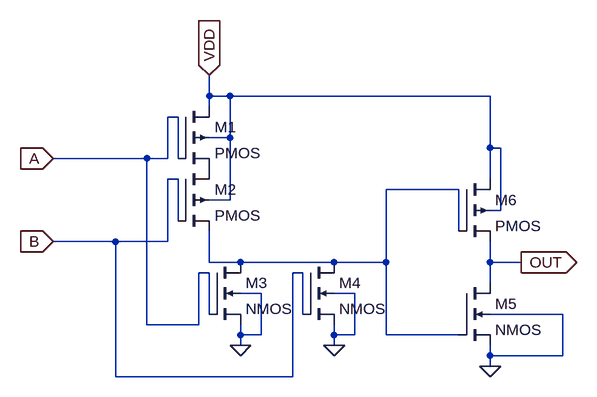
[diagram p0: schematic or.asc]
or.asc, the LTspice schematic file:
Version 4
SHEET 1 1084 680
WIRE 32 -32 32 -64
WIRE 64 -32 32 -32
WIRE 464 -32 64 -32
WIRE 32 -16 32 -32
WIRE -16 0 -32 0
WIRE 64 32 64 -32
WIRE 64 32 32 32
WIRE 464 48 464 -32
WIRE 480 48 464 48
WIRE -64 64 -208 64
WIRE -32 64 -32 0
WIRE -32 64 -64 64
WIRE -16 64 -16 0
WIRE -16 96 -32 96
WIRE 464 96 464 48
WIRE 416 112 304 112
WIRE 64 128 64 32
WIRE 64 128 32 128
WIRE 480 144 480 48
WIRE 480 144 464 144
WIRE -16 160 -16 96
WIRE 416 176 416 112
WIRE -112 192 -208 192
WIRE -32 192 -32 96
WIRE -32 192 -112 192
WIRE 32 224 32 176
WIRE 80 224 32 224
WIRE 224 224 80 224
WIRE 304 224 304 112
WIRE 304 224 224 224
WIRE 464 224 464 192
WIRE 512 224 464 224
WIRE 32 240 16 240
WIRE 176 240 160 240
WIRE 464 256 464 224
WIRE 112 272 80 272
WIRE 256 272 224 272
WIRE 32 304 32 240
WIRE 176 304 176 240
WIRE 576 304 464 304
WIRE -64 320 -64 64
WIRE 16 320 16 240
WIRE 16 320 -64 320
WIRE 80 336 80 320
WIRE 112 336 112 272
WIRE 112 336 80 336
WIRE 224 336 224 320
WIRE 256 336 256 272
WIRE 256 336 224 336
WIRE 304 336 304 224
WIRE 416 336 304 336
WIRE 80 352 80 336
WIRE 224 352 224 336
WIRE 464 368 464 352
WIRE 576 368 576 304
WIRE 576 368 464 368
WIRE 464 384 464 368
WIRE -112 400 -112 192
WIRE 160 400 160 240
WIRE 160 400 -112 400
FLAG 32 -64 VDD
IOPIN 32 -64 In
FLAG 80 352 0
FLAG 224 352 0
FLAG -208 64 A
IOPIN -208 64 In
FLAG -208 192 B
IOPIN -208 192 In
FLAG 464 384 0
FLAG 512 224 OUT
IOPIN 512 224 Out
SYMBOL pmos4 -16 -16 R0
SYMATTR InstName M1
SYMATTR Value2 l=90n w=400n
SYMBOL pmos4 -16 80 R0
SYMATTR InstName M2
SYMATTR Value2 l=90n w=400n
SYMBOL nmos4 32 224 R0
SYMATTR InstName M3
SYMATTR Value2 l=90n w=200n
SYMBOL nmos4 176 224 R0
SYMATTR InstName M4
SYMATTR Value2 l=90n w=200n
SYMBOL nmos4 416 256 R0
SYMATTR Value2 l=90n w=200n
SYMATTR InstName M5
SYMBOL pmos4 416 96 R0
SYMATTR Value2 l=90n w=400n
SYMATTR InstName M6

The netlist it stands for:
* or.asc
M1 VDD A P001 VDD PMOS l=90n w=400n
M2 P001 B N001 VDD PMOS l=90n w=400n
M3 N001 A 0 0 NMOS l=90n w=200n
M4 N001 B 0 0 NMOS l=90n w=200n
M5 OUT N001 0 0 NMOS l=90n w=200n
M6 VDD N001 OUT VDD PMOS l=90n w=400n
.model NMOS NMOS
.model PMOS PMOS
.lib standard.mos
.backanno
.end